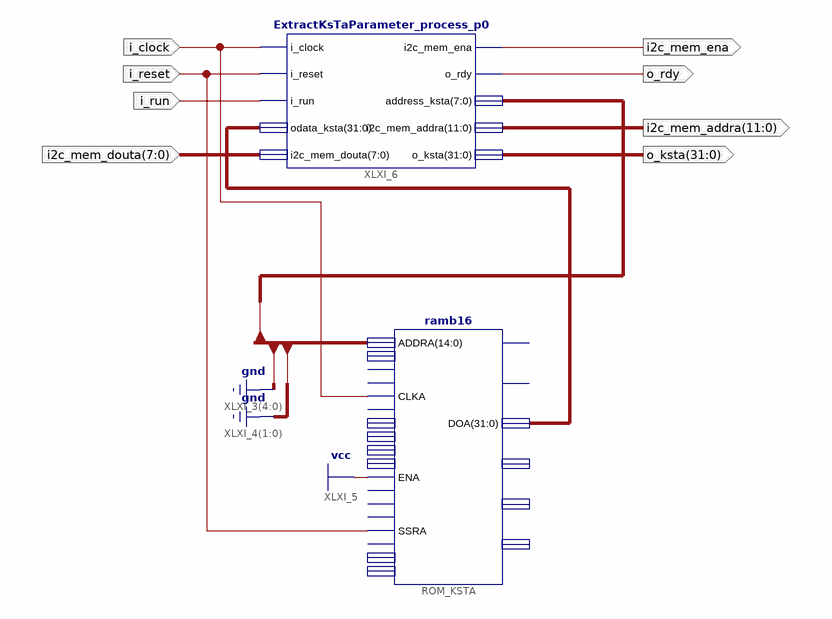
[diagram p0: schematic sheet 1]
// Xilinx ISE schematic ExtractKsTaParameters.sch (virtex4) as structural Verilog: 2 symbols, 8 ports
module ExtractKsTaParameters (
  input  i_clock,
  input  i_reset,
  input  i_run,
  input  [7:0] i2c_mem_douta,
  output i2c_mem_ena,
  output o_rdy,
  output [11:0] i2c_mem_addra,
  output [31:0] o_ksta
);

  wire [12:5] XLXN_1;
  wire [31:0] XLXN_84;

  ramb16 #(.INIT_00("3a6000003a4000003a2000003a00000039c00000398000003900000000000000"), .INIT_01("3af000003ae000003ad000003ac000003ab000003aa000003a9000003a800000"), .WRITE_WIDTH_B(36), .WRITE_WIDTH_A(36), .WRITE_MODE_B("READ_FIRST"), .WRITE_MODE_A("READ_FIRST"), .READ_WIDTH_B(36), .READ_WIDTH_A(36), .INIT_1F("b9000000b9800000b9c00000ba000000ba200000ba400000ba600000ba800000"), .INIT_1E("ba900000baa00000bab00000bac00000bad00000bae00000baf00000bb000000"), .INIT_1D("bb080000bb100000bb180000bb200000bb280000bb300000bb380000bb400000"), .INIT_1C("bb480000bb500000bb580000bb600000bb680000bb700000bb780000bb800000"), .INIT_1B("bb840000bb880000bb8c0000bb900000bb940000bb980000bb9c0000bba00000"), .INIT_1A("bba40000bba80000bbac0000bbb00000bbb40000bbb80000bbbc0000bbc00000"), .INIT_19("bbc40000bbc80000bbcc0000bbd00000bbd40000bbd80000bbdc0000bbe00000"), .INIT_18("bbe40000bbe80000bbec0000bbf00000bbf40000bbf80000bbfc0000bc000000"), .INIT_17("bc020000bc040000bc060000bc080000bc0a0000bc0c0000bc0e0000bc100000"), .INIT_16("bc120000bc140000bc160000bc180000bc1a0000bc1c0000bc1e0000bc200000"), .INIT_15("bc220000bc240000bc260000bc280000bc2a0000bc2c0000bc2e0000bc300000"), .INIT_14("bc320000bc340000bc360000bc380000bc3a0000bc3c0000bc3e0000bc400000"), .INIT_13("bc420000bc440000bc460000bc480000bc4a0000bc4c0000bc4e0000bc500000"), .INIT_12("bc520000bc540000bc560000bc580000bc5a0000bc5c0000bc5e0000bc600000"), .INIT_11("bc620000bc640000bc660000bc680000bc6a0000bc6c0000bc6e0000bc700000"), .INIT_10("bc720000bc740000bc760000bc780000bc7a0000bc7c0000bc7e0000bc800000"), .INIT_0F("3c7e00003c7c00003c7a00003c7800003c7600003c7400003c7200003c700000"), .INIT_0E("3c6e00003c6c00003c6a00003c6800003c6600003c6400003c6200003c600000"), .INIT_0D("3c5e00003c5c00003c5a00003c5800003c5600003c5400003c5200003c500000"), .INIT_0C("3c4e00003c4c00003c4a00003c4800003c4600003c4400003c4200003c400000"), .INIT_0B("3c3e00003c3c00003c3a00003c3800003c3600003c3400003c3200003c300000"), .INIT_0A("3c2e00003c2c00003c2a00003c2800003c2600003c2400003c2200003c200000"), .INIT_09("3c1e00003c1c00003c1a00003c1800003c1600003c1400003c1200003c100000"), .INIT_08("3c0e00003c0c00003c0a00003c0800003c0600003c0400003c0200003c000000"), .INIT_07("3bfc00003bf800003bf400003bf000003bec00003be800003be400003be00000"), .INIT_06("3bdc00003bd800003bd400003bd000003bcc00003bc800003bc400003bc00000"), .INIT_05("3bbc00003bb800003bb400003bb000003bac00003ba800003ba400003ba00000"), .INIT_04("3b9c00003b9800003b9400003b9000003b8c00003b8800003b8400003b800000"), .INIT_03("3b7800003b7000003b6800003b6000003b5800003b5000003b4800003b400000"), .INIT_02("3b3800003b3000003b2800003b2000003b1800003b1000003b0800003b000000")) ROM_KSTA (
    .ADDRA({2'b00, XLXN_1, {5{1'b0}}}), .CLKA(i_clock), .ENA(1'b1), .SSRA(i_reset), .DOA(XLXN_84));  // open: ADDRB, CASCADEINA, CASCADEINB, CLKB, DIA, DIB, DIPA, DIPB, REGCEA, REGCEB, ENB, SSRB, WEA, WEB, CASCADEOUTA, CASCADEOUTB, DOB, DOPA, DOPB
  ExtractKsTaParameter_process_p0 XLXI_6 (
    .i_clock(i_clock), .i_reset(i_reset), .i_run(i_run), .odata_ksta(XLXN_84), .i2c_mem_douta(i2c_mem_douta),
    .i2c_mem_ena(i2c_mem_ena), .o_rdy(o_rdy), .address_ksta(XLXN_1), .i2c_mem_addra(i2c_mem_addra),
    .o_ksta(o_ksta));
endmodule
